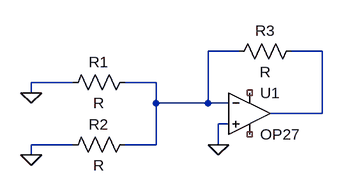
[diagram p0: schematic Draft1.asc]
Draft1.asc, the LTspice schematic file:
Version 4.1
SHEET 1 880 680
WIRE 160 64 112 64
WIRE 288 64 240 64
WIRE -96 112 -160 112
WIRE 32 112 -16 112
WIRE -160 128 -160 112
WIRE 32 144 32 112
WIRE 112 144 112 64
WIRE 112 144 32 144
WIRE 144 144 112 144
WIRE 288 160 288 64
WIRE 288 160 208 160
WIRE 144 176 128 176
WIRE -96 208 -160 208
WIRE 32 208 32 144
WIRE 32 208 -16 208
WIRE 128 208 128 176
WIRE -160 224 -160 208
FLAG 128 208 0
FLAG -160 224 0
FLAG -160 128 0
SYMBOL OpAmps\\OP27 176 96 R0
SYMATTR InstName U1
SYMBOL res 0 96 R90
WINDOW 0 0 56 VBottom 2
WINDOW 3 32 56 VTop 2
SYMATTR InstName R1
SYMBOL res 0 192 R90
WINDOW 0 0 56 VBottom 2
WINDOW 3 32 56 VTop 2
SYMATTR InstName R2
SYMBOL res 256 48 R90
WINDOW 0 0 56 VBottom 2
WINDOW 3 32 56 VTop 2
SYMATTR InstName R3

The netlist it stands for:
* Draft1.asc
X§U1 0 N001 NC_01 NC_02 N002 OP27  ; pins In+ In- V+ V- OUT
R1 N001 0 R
R2 N001 0 R
R3 N002 N001 R
.lib ADI.lib
.backanno
.end